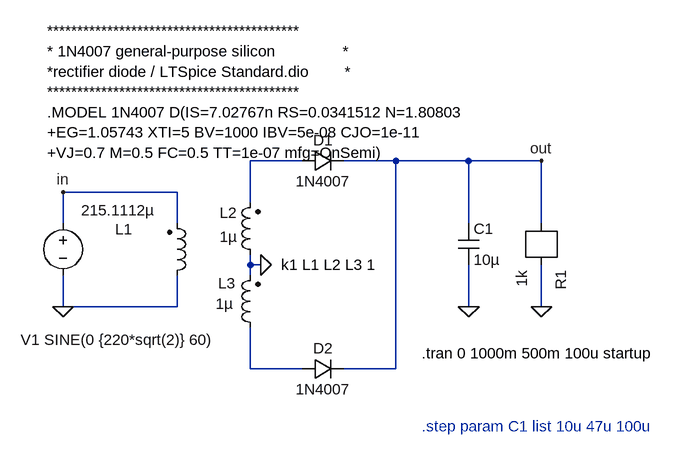
[diagram p0: schematic lab2_ex1.asc]
lab2_ex1.asc, the LTspice schematic file:
Version 4
SHEET 1 1160 712
WIRE 576 272 496 272
WIRE 720 272 640 272
WIRE 832 272 720 272
WIRE 944 272 832 272
WIRE 384 320 208 320
WIRE 496 336 496 272
WIRE 208 368 208 320
WIRE 384 368 384 320
WIRE 832 368 832 272
WIRE 944 368 944 272
WIRE 496 432 496 416
WIRE 512 432 496 432
WIRE 496 448 496 432
WIRE 208 496 208 448
WIRE 384 496 384 448
WIRE 384 496 208 496
WIRE 832 496 832 432
WIRE 944 496 944 432
WIRE 496 592 496 528
WIRE 576 592 496 592
WIRE 720 592 720 272
WIRE 720 592 640 592
FLAG 512 432 0
FLAG 832 496 0
FLAG 944 496 0
FLAG 208 320 in
FLAG 944 272 out
FLAG 208 496 0
SYMBOL voltage 208 352 R0
WINDOW 0 -65 195 Left 2
WINDOW 3 -29 195 Left 2
SYMATTR InstName V1
SYMATTR Value SINE(0 {220*sqrt(2)} 60)
SYMBOL r 944 368 R90
SYMATTR InstName R1
SYMATTR Value 1k
SYMBOL cap 816 368 R0
SYMATTR InstName C1
SYMATTR Value 10µ
SYMBOL ind2 368 464 M180
WINDOW 0 -80 87 Left 2
WINDOW 3 -132 116 Left 2
SYMATTR InstName L1
SYMATTR Value 215.1112µ
SYMATTR Type ind
SYMATTR SpiceLine Rser=1m
SYMBOL ind2 512 432 R180
WINDOW 0 36 80 Left 2
WINDOW 3 36 43 Left 2
SYMATTR InstName L2
SYMATTR Value 1µ
SYMATTR Type ind
SYMATTR SpiceLine Rser=0
SYMBOL ind2 512 544 R180
WINDOW 0 38 84 Left 2
WINDOW 3 42 52 Left 2
SYMATTR InstName L3
SYMATTR Value 1µ
SYMATTR Type ind
SYMATTR SpiceLine Rser=0
SYMBOL diode 576 288 R270
WINDOW 0 32 32 VTop 2
WINDOW 3 0 32 VBottom 2
SYMATTR InstName D1
SYMATTR Value 1N4007
SYMBOL diode 576 608 R270
WINDOW 0 32 32 VTop 2
WINDOW 3 0 32 VBottom 2
SYMATTR InstName D2
SYMATTR Value 1N4007
TEXT 184 72 Left 2 !******************************************\n* 1N4007 general-purpose silicon       		*\n*rectifier diode / LTSpice Standard.dio		*\n******************************************\n.MODEL 1N4007 D(IS=7.02767n RS=0.0341512 N=1.80803 \n+EG=1.05743 XTI=5 BV=1000 IBV=5e-08 CJO=1e-11 \n+VJ=0.7 M=0.5 FC=0.5 TT=1e-07 mfg=OnSemi)
TEXT 544 432 Left 2 !k1 L1 L2 L3 1
TEXT 760 568 Left 2 !.tran 0 1000m 500m 100u startup
TEXT 760 680 Left 2 ;.step param C1 list 10u 47u 100u

The netlist it stands for:
* lab2_ex1.asc
V1 in 0 SINE(0 {220*sqrt(2)} 60)
R1 0 out 1k
C1 out 0 10µ
L1 0 in 215.1112µ Rser=1m
L2 0 N001 1µ Rser=0
L3 N002 0 1µ Rser=0
D1 N001 out 1N4007
D2 N002 out 1N4007
.model D D
.lib standard.dio
******************************************
* 1N4007 general-purpose silicon       		*
*rectifier diode / LTSpice Standard.dio		*
******************************************
.MODEL 1N4007 D(IS=7.02767n RS=0.0341512 N=1.80803
+EG=1.05743 XTI=5 BV=1000 IBV=5e-08 CJO=1e-11
+VJ=0.7 M=0.5 FC=0.5 TT=1e-07 mfg=OnSemi)
k1 L1 L2 L3 1
.tran 0 1000m 500m 100u startup
* .step param C1 list 10u 47u 100u
.backanno
.end